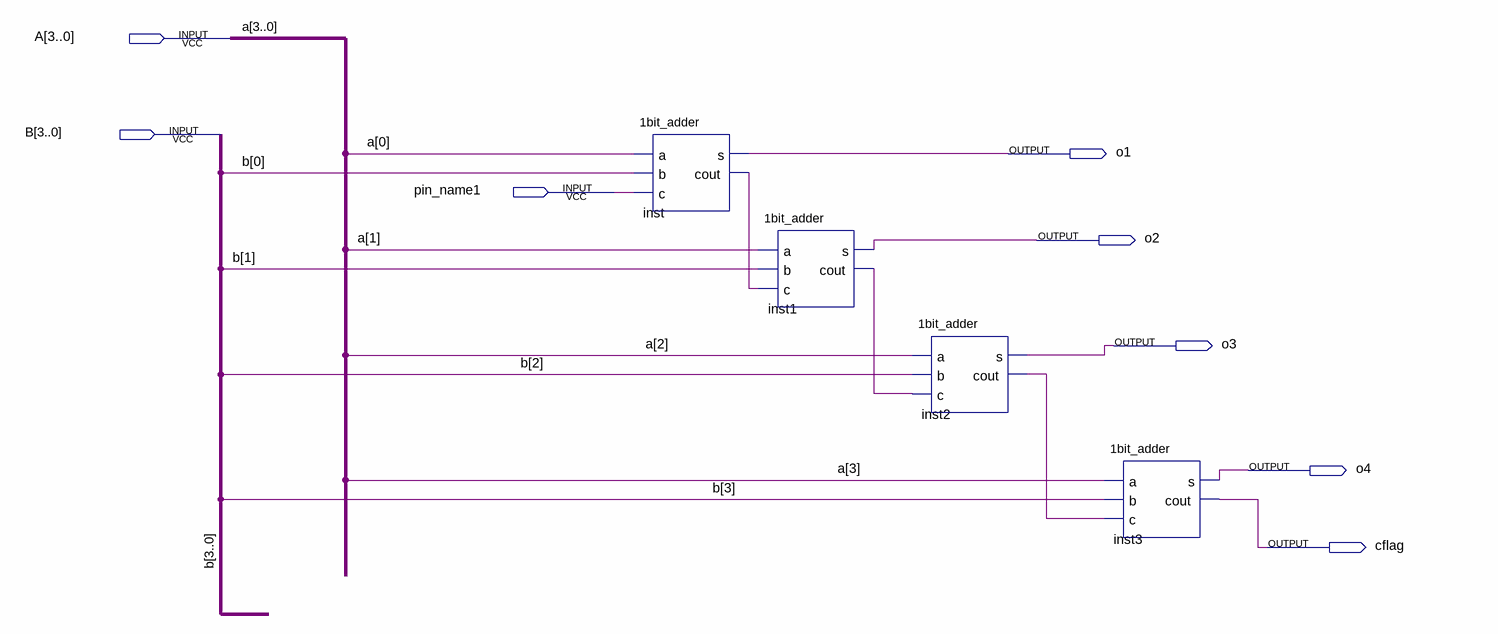
[diagram p0: schematic sheet]
// Quartus schematic 4bit_adder.bdf as structural Verilog: 4 symbols, 8 pins
module \4bit_adder  (
  input  [3:0] A,
  input  [3:0] B,
  input  pin_name1,
  output o1,
  output o2,
  output o3,
  output o4,
  output cflag
);

  wire inst1_cout, inst2_cout, inst_cout;

  \1bit_adder  inst (.a(A[0]), .b(B[0]), .c(pin_name1), .s(o1), .cout(inst_cout));
  \1bit_adder  inst1 (.a(A[1]), .b(B[1]), .c(inst_cout), .s(o2), .cout(inst1_cout));
  \1bit_adder  inst2 (.a(A[2]), .b(B[2]), .c(inst1_cout), .s(o3), .cout(inst2_cout));
  \1bit_adder  inst3 (.a(A[3]), .b(B[3]), .c(inst2_cout), .s(o4), .cout(cflag));
endmodule
